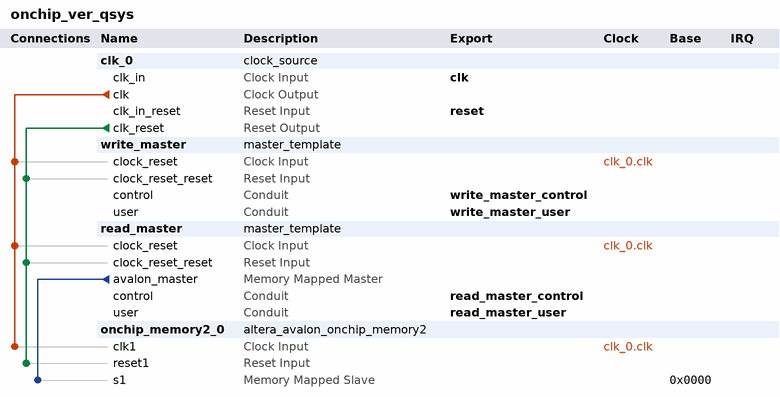
[diagram p0: system contents]
# Platform Designer (Qsys) system onchip_ver_qsys, Cyclone IV GX EP4CGX150DF31C7
# Parameters at their usual value, and those the tool derives, are not listed.
package require -exact qsys 13.0
create_system onchip_ver_qsys
set_project_property DEVICE_FAMILY {Cyclone IV GX}
set_project_property DEVICE EP4CGX150DF31C7

add_instance clk_0 clock_source 13.0
set_instance_parameter_value clk_0 clockFrequency 50000000

add_instance write_master master_template 1.0
set_instance_parameter_value write_master MASTER_DIRECTION 1
set_instance_parameter_value write_master DATA_WIDTH 32
set_instance_parameter_value write_master ADDRESS_WIDTH 26
set_instance_parameter_value write_master BURST_CAPABLE 0
set_instance_parameter_value write_master MAXIMUM_BURST_COUNT 2
set_instance_parameter_value write_master FIFO_DEPTH 16
set_instance_parameter_value write_master MEMORY_BASED_FIFO 1

add_instance read_master master_template 1.0
set_instance_parameter_value read_master MASTER_DIRECTION 0
set_instance_parameter_value read_master DATA_WIDTH 32
set_instance_parameter_value read_master ADDRESS_WIDTH 26
set_instance_parameter_value read_master BURST_CAPABLE 0
set_instance_parameter_value read_master MAXIMUM_BURST_COUNT 2
set_instance_parameter_value read_master FIFO_DEPTH 32
set_instance_parameter_value read_master MEMORY_BASED_FIFO 1

add_instance onchip_memory2_0 altera_avalon_onchip_memory2 13.0.1.99.2
set_instance_parameter_value onchip_memory2_0 allowInSystemMemoryContentEditor true
set_instance_parameter_value onchip_memory2_0 dataWidth 32
set_instance_parameter_value onchip_memory2_0 dualPort false
set_instance_parameter_value onchip_memory2_0 initMemContent true
set_instance_parameter_value onchip_memory2_0 initializationFileName onchip_mem.hex
set_instance_parameter_value onchip_memory2_0 instanceID RAM
set_instance_parameter_value onchip_memory2_0 memorySize 256
set_instance_parameter_value onchip_memory2_0 slave1Latency 2

# connections
add_connection clk_0.clk onchip_memory2_0.clk1 clock
add_connection clk_0.clk read_master.clock_reset clock
add_connection clk_0.clk write_master.clock_reset clock
add_connection clk_0.clk_reset onchip_memory2_0.reset1 reset
add_connection clk_0.clk_reset read_master.clock_reset_reset reset
add_connection clk_0.clk_reset write_master.clock_reset_reset reset
add_connection read_master.avalon_master onchip_memory2_0.s1 avalon
set_connection_parameter_value read_master.avalon_master/onchip_memory2_0.s1 baseAddress 0x0000

# exported interfaces
add_interface clk clock sink
set_interface_property clk EXPORT_OF clk_0.clk_in
add_interface reset reset sink
set_interface_property reset EXPORT_OF clk_0.clk_in_reset
add_interface write_master_control conduit end
set_interface_property write_master_control EXPORT_OF write_master.control
add_interface write_master_user conduit end
set_interface_property write_master_user EXPORT_OF write_master.user
add_interface read_master_control conduit end
set_interface_property read_master_control EXPORT_OF read_master.control
add_interface read_master_user conduit end
set_interface_property read_master_user EXPORT_OF read_master.user

set_interconnect_requirement {$system} qsys_mm.clockCrossingAdapter HANDSHAKE
set_interconnect_requirement {$system} qsys_mm.maxAdditionalLatency 1

save_system onchip_ver_qsys.qsys
